# Altium schematic sheet IRComms.SchDoc
size A
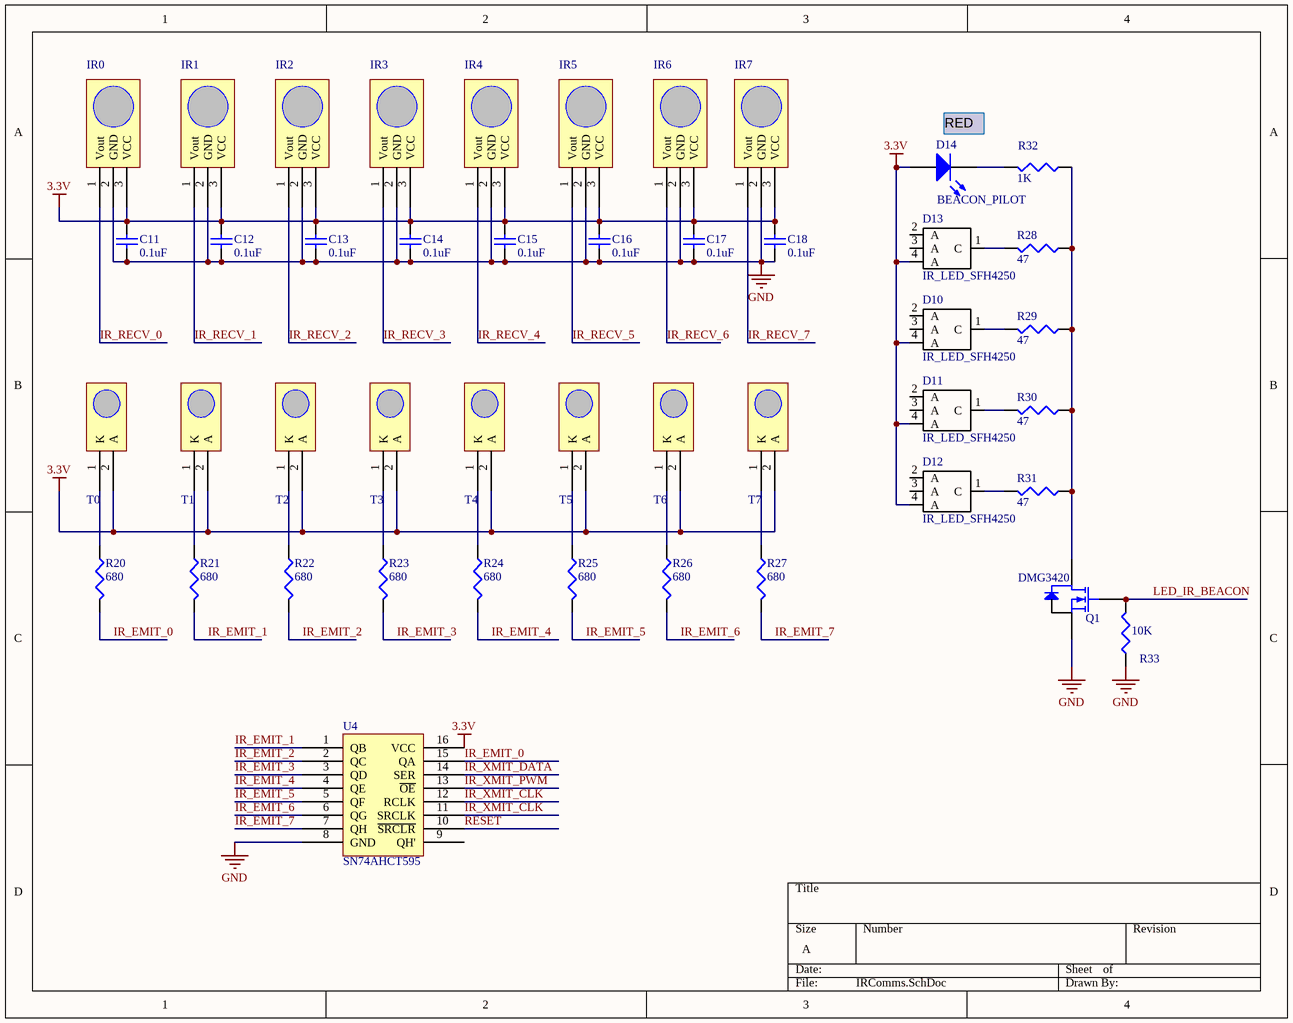
[diagram p0: IRComms.SchDoc]

## Parts
C11  value 0.1uF  [CAPC1005L]  (hidden comment: Cap Semi)
C12  value 0.1uF  [CAPC1005L]  (hidden comment: Cap Semi)
C13  value 0.1uF  [CAPC1005L]  (hidden comment: Cap Semi)
C14  value 0.1uF  [CAPC1005L]  (hidden comment: Cap Semi)
C15  value 0.1uF  [CAPC1005L]  (hidden comment: Cap Semi)
C16  value 0.1uF  [CAPC1005L]  (hidden comment: Cap Semi)
C17  value 0.1uF  [CAPC1005L]  (hidden comment: Cap Semi)
C18  value 0.1uF  [CAPC1005L]  (hidden comment: Cap Semi)
D10  IR_LED_SFH4250  [IR_LED_SFH4250]
D11  IR_LED_SFH4250  [IR_LED_SFH4250]
D12  IR_LED_SFH4250  [IR_LED_SFH4250]
D13  IR_LED_SFH4250  [IR_LED_SFH4250]
D14  BEACON_PILOT  [SurfaceMount(603)]
IR0  GP1UX31QS  [GP1UX31QS]  (value not drawn)
IR1  GP1UX31QS  [GP1UX31QS]  (value not drawn)
IR2  GP1UX31QS  [GP1UX31QS]  (value not drawn)
IR3  GP1UX31QS  [GP1UX31QS]  (value not drawn)
IR4  GP1UX31QS  [GP1UX31QS]  (value not drawn)
IR5  GP1UX31QS  [GP1UX31QS]  (value not drawn)
IR6  GP1UX31QS  [GP1UX31QS]  (value not drawn)
IR7  GP1UX31QS  [GP1UX31QS]  (value not drawn)
Q1  MPN: DMG3420  [SOT-23]  (hidden comment: Mosfet)
R20  value 680  [RESC1608L]  (hidden comment: Res3)
R21  value 680  [RESC1608L]  (hidden comment: Res3)
R22  value 680  [RESC1608L]  (hidden comment: Res3)
R23  value 680  [RESC1608L]  (hidden comment: Res3)
R24  value 680  [RESC1608L]  (hidden comment: Res3)
R25  value 680  [RESC1608L]  (hidden comment: Res3)
R26  value 680  [RESC1608L]  (hidden comment: Res3)
R27  value 680  [RESC1608L]  (hidden comment: Res3)
R28  value 47  [RESC1608L]  (hidden comment: Res3)
R29  value 47  [RESC1608L]  (hidden comment: Res3)
R30  value 47  [RESC1608L]  (hidden comment: Res3)
R31  value 47  [RESC1608L]  (hidden comment: Res3)
R32  value 1K  [RESC1608L]  (hidden comment: Res3)
R33  value 10K  [RESC1608L]  (hidden comment: Res3)
T0  LN54  [LN54]  (value not drawn)
T1  LN54  [LN54]  (value not drawn)
T2  LN54  [LN54]  (value not drawn)
T3  LN54  [LN54]  (value not drawn)
T4  LN54  [LN54]  (value not drawn)
T5  LN54  [LN54]  (value not drawn)
T6  LN54  [LN54]  (value not drawn)
T7  LN54  [LN54]  (value not drawn)
U4  SN74AHCT595  [TSSOP-16]

## Nets
3.3V: C11.2 C12.2 C13.2 C14.2 C15.2 C16.2 C17.2 C18.2 D10.4(A) D11.4(A) D12.4(A) D13.4(A) D14.1(A) IR0.3(VCC) IR1.3(VCC) IR2.3(VCC) IR3.3(VCC) IR4.3(VCC) IR5.3(VCC) IR6.3(VCC) IR7.3(VCC) T0.2(A) T1.2(A) T2.2(A) T3.2(A) T4.2(A) T5.2(A) T6.2(A) T7.2(A) U4.16(VCC)
GND: C11.1 C12.1 C13.1 C14.1 C15.1 C16.1 C17.1 C18.1 IR0.2(GND) IR1.2(GND) IR2.2(GND) IR3.2(GND) IR4.2(GND) IR5.2(GND) IR6.2(GND) IR7.2(GND) Q1.2(S) R33.1 U4.8(GND)
IR_EMIT_0: R20.2 U4.15(QA)
IR_EMIT_1: R21.2 U4.1(QB)
IR_EMIT_2: R22.2 U4.2(QC)
IR_EMIT_3: R23.2 U4.3(QD)
IR_EMIT_4: R24.2 U4.4(QE)
IR_EMIT_5: R25.2 U4.5(QF)
IR_EMIT_6: R26.2 U4.6(QG)
IR_EMIT_7: R27.2 U4.7(QH)
IR_RECV_0: IR0.1(Vout)
IR_RECV_1: IR1.1(Vout)
IR_RECV_2: IR2.1(Vout)
IR_RECV_3: IR3.1(Vout)
IR_RECV_4: IR4.1(Vout)
IR_RECV_5: IR5.1(Vout)
IR_RECV_6: IR6.1(Vout)
IR_RECV_7: IR7.1(Vout)
IR_XMIT_CLK: U4.11(SRCLK) U4.12(RCLK)
IR_XMIT_DATA: U4.14(SER)
IR_XMIT_PWM: U4.13(~{OE})
LED_IR_BEACON: Q1.1(G) R33.2
RESET: U4.10(~{SRCLR})
NetD10_1: D10.1(C) R29.2
NetD11_1: D11.1(C) R30.2
NetD12_1: D12.1(C) R31.2
NetD13_1: D13.1(C) R28.2
NetD14_2: D14.2(K) R32.2
NetQ1_3: Q1.3(D) R28.1 R29.1 R30.1 R31.1 R32.1
NetR20_1: R20.1 T0.1(K)
NetR21_1: R21.1 T1.1(K)
NetR22_1: R22.1 T2.1(K)
NetR23_1: R23.1 T3.1(K)
NetR24_1: R24.1 T4.1(K)
NetR25_1: R25.1 T5.1(K)
NetR26_1: R26.1 T6.1(K)
NetR27_1: R27.1 T7.1(K)

Not connected (* = marked no-connect by the designer): D10 2(A) 3(A); D11 2(A) 3(A); D12 2(A) 3(A); D13 2(A) 3(A); U4 9(QH')

## Notes on the sheet
- RED

## Library data of the parts
C11-C18 = Cap Semi: Capacitor (Semiconductor SIM Model); Published: 8-Jun-2000; LatestRevisionDate: 29-May-2009; LatestRevisionNote: IPC-7351 Footprint Added.; PackageReference: C1206; Publisher: Altium Limited; PackageDescription: Chip Capacitor
D14 = LED
R20-R33 = Res3: Resistor; Published: 8-Jun-2000; LatestRevisionDate: 29-May-2009; LatestRevisionNote: IPC-7351 Footprint Added.; PackageReference: J1-0603; Publisher: Altium Limited; PackageDescription: Chip Resistor
U4 = SN74AHCT595: shift register